# Altium project Common-Base Amplifier.PRJPCB
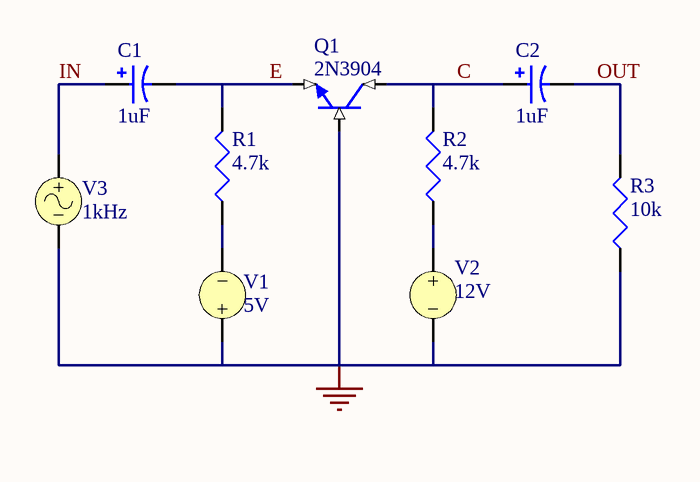
[diagram p0: Common-Base Amplifier.schdoc]
1 sheet, 9 parts. Net scope: global (net labels, ports and power ports of the same name join across sheets).

## Sheet Common-Base Amplifier.schdoc: Common Base Amplifier
size A4; Organization: Altium Limited; Address1: L3, 12a Rodborough Rd; Address2: Frenchs Forest; Address3: NSW; Address4: Australia 2086; DocumentNumber: 1; SheetNumber: 1; SheetTotal: 1

### Parts
C1  1uF
C2  1uF
Q1  2N3904
R1  4.7k
R2  4.7k
R3  10k
V1  5V
V2  12V
V3  1kHz

### Nets
GND: Q1.2(B) R3.2(BOT) V1.1 V2.2 V3.2
C: C2.1 Q1.1(C) R2.1(TOP)
E: C1.2 Q1.3(E) R1.1(TOP)
IN: C1.1 V3.1
OUT: C2.2 R3.1(TOP)
NetR1_2: R1.2(BOT) V1.2
NetR2_2: R2.2(BOT) V2.1

### Notes on the sheet
- Title
- Size:
- Date:
- A4
- Number:
- Time:
- Revision:
- Sheet
- of
- File:

### Library data of the parts
C1 C2 = CAP2: Bi-Polar Capacitor; Value: 1uF
Q1 = 2N3904: NPN BJT
R1-R3 = RES: Resistor
  R1 R2: Value: 4.7k
  R3: Value: 10k
V1 V2 = VSRC: Voltage Source
  V1: Value: 5V
  V2: Value: 12V
V3 = VSIN: Sinusoidal Voltage Source